# Altium schematic sheet eeprom.SchDoc
size A
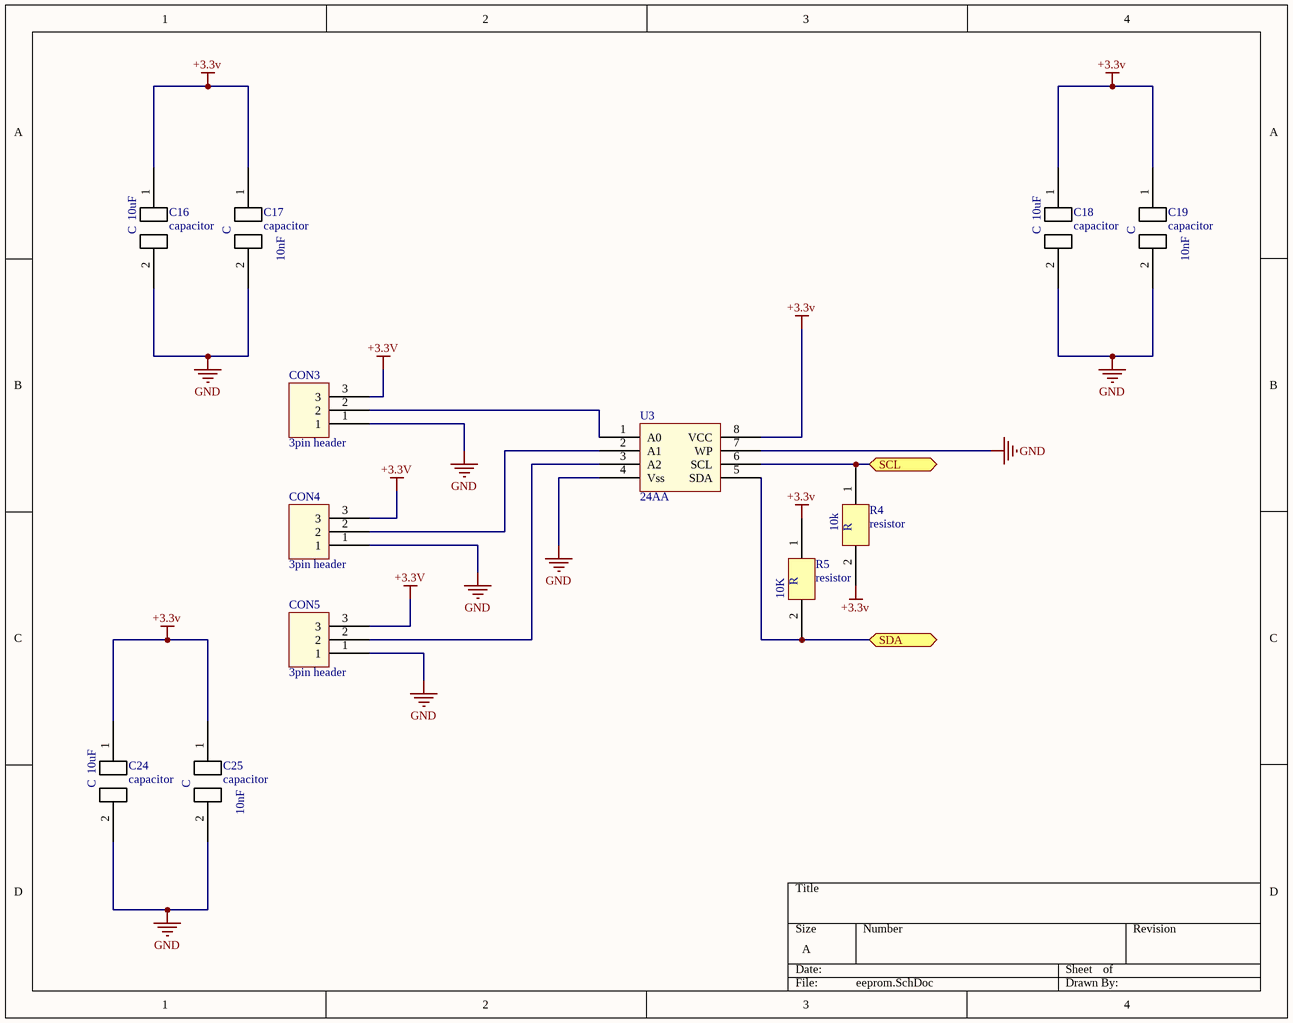
[diagram p0: eeprom.SchDoc]

## Parts
C16  capacitor  [0603]
C17  capacitor  [0603]
C18  capacitor  [0603]
C19  capacitor  [0603]
C24  capacitor  [0603]
C25  capacitor  [0603]
CON3  3pin header  [PCBComponent_1]
CON4  3pin header  [PCBComponent_1]
CON5  3pin header  [PCBComponent_1]
R4  resistor  [0603]
R5  resistor  [0603]
U3  24AA  [24AA soic]

## Ports
SCL, SDA

## Nets
+3.3v: C16.1 C17.1 C18.1 C19.1 C24.1 C25.1 CON3.3 CON4.3 CON5.3 R4.2 R5.1 U3.8(VCC)
GND: C16.2 C17.2 C18.2 C19.2 C24.2 C25.2 CON3.1 CON4.1 CON5.1 U3.4(Vss) U3.7(WP)
SCL: R4.1 U3.6(SCL) ; port SCL
SDA: R5.2 U3.5(SDA) ; port SDA
NetCON3_2: CON3.2 U3.1(A0)
NetCON4_2: CON4.2 U3.2(A1)
NetCON5_2: CON5.2 U3.3(A2)

## Notes on the sheet
- (in symbol capacitor) 10uF; C; 10nF
- (in symbol resistor) R; 10K; 10k